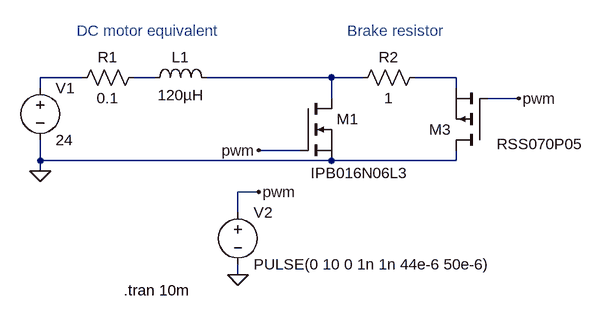
[diagram p0: schematic BrakeResistor.asc]
BrakeResistor.asc, the LTspice schematic file:
Version 4
SHEET 1 900 680
WIRE 0 128 -64 128
WIRE 112 128 80 128
WIRE 384 128 192 128
WIRE 432 128 384 128
WIRE 576 128 512 128
WIRE -64 144 -64 128
WIRE 576 144 576 128
WIRE 384 160 384 128
WIRE 672 160 624 160
WIRE 336 240 272 240
WIRE -64 256 -64 224
WIRE 384 256 384 240
WIRE 384 256 -64 256
WIRE 576 256 576 240
WIRE 576 256 384 256
WIRE -64 272 -64 256
WIRE 272 304 240 304
WIRE 240 336 240 304
WIRE 240 432 240 416
FLAG -64 272 0
FLAG 240 432 0
FLAG 272 304 pwm
FLAG 672 160 pwm
FLAG 272 240 pwm
SYMBOL voltage -64 128 R0
WINDOW 123 0 0 Left 2
WINDOW 39 0 0 Left 2
SYMATTR InstName V1
SYMATTR Value 24
SYMBOL res -16 144 R270
WINDOW 0 32 56 VTop 2
WINDOW 3 0 56 VBottom 2
SYMATTR InstName R1
SYMATTR Value 0.1
SYMBOL ind 96 144 R270
WINDOW 0 32 56 VTop 2
WINDOW 3 5 56 VBottom 2
SYMATTR InstName L1
SYMATTR Value 120µH
SYMBOL res 416 144 R270
WINDOW 0 32 56 VTop 2
WINDOW 3 0 56 VBottom 2
SYMATTR InstName R2
SYMATTR Value 1
SYMBOL voltage 240 320 R0
WINDOW 123 0 0 Left 2
WINDOW 39 0 0 Left 2
SYMATTR InstName V2
SYMATTR Value PULSE(0 10 0 1n 1n 44e-6 50e-6)
SYMBOL nmos 336 160 R0
WINDOW 3 16 115 Left 2
SYMATTR Value IPB016N06L3
SYMATTR InstName M1
SYMBOL pmos 624 240 R180
WINDOW 3 -146 10 Left 2
SYMATTR Value RSS070P05
SYMATTR InstName M3
TEXT 64 456 Left 2 !.tran 10m
TEXT -8 56 Left 2 ;DC motor equivalent
TEXT 408 56 Left 2 ;Brake resistor

The netlist it stands for:
* BrakeResistor.asc
V1 N001 0 24
R1 N001 N002 0.1
L1 N002 N003 120µH
R2 N003 N004 1
V2 pwm 0 PULSE(0 10 0 1n 1n 44e-6 50e-6)
M1 N003 pwm 0 0 IPB016N06L3
M3 0 pwm N004 N004 RSS070P05
.model NMOS NMOS
.model PMOS PMOS
.lib standard.mos
.tran 10m
* DC motor equivalent
* Brake resistor
.backanno
.end